# Altium project Laser-Light cueing.PrjPcb
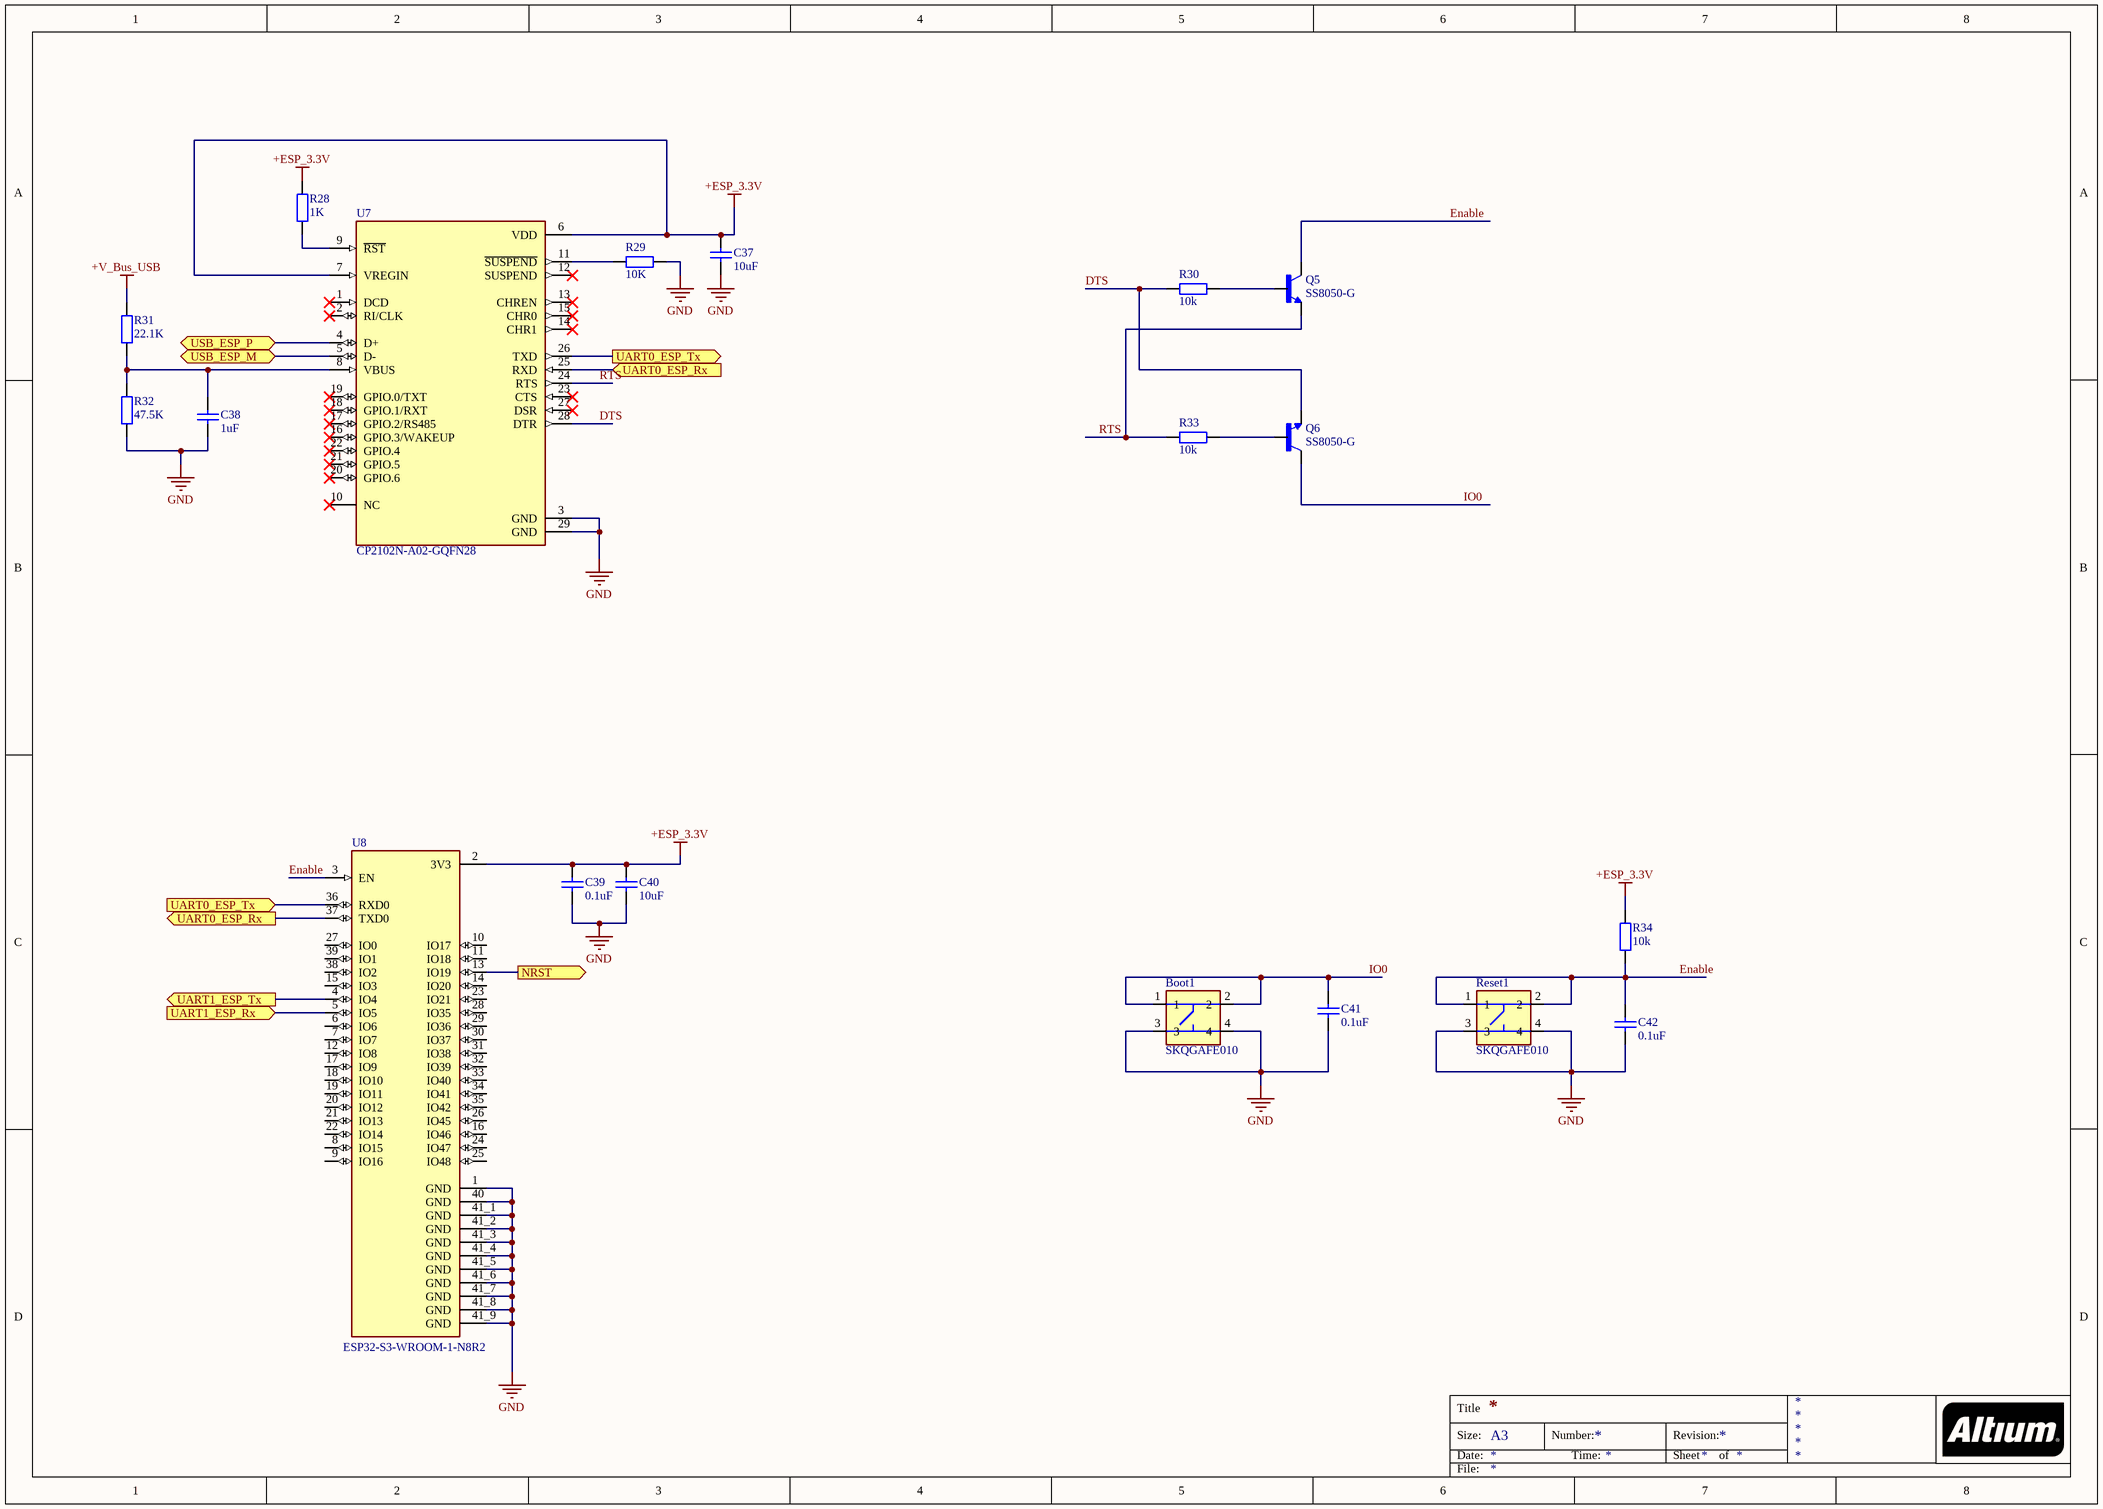
[diagram p0: ESP32.SchDoc]
5 sheets, 116 parts. Net scope: flat (ports and power ports of the same name join across sheets).
Sheets:
  ESP32.SchDoc
  AnalogSensor.SchDoc
  STM32.SchDoc
  Peripherial.SchDoc
  PWR_SRC.SchDoc

## Sheet ESP32.SchDoc
size A3

### Parts
Boot1  SKQGAFE010  [SW_SKQGAFE010]
C37  10uF  [tu 0805]
C38  1uF  [tu 0805]
C39  0.1uF  [tu 0805]
C40  10uF  [tu 0805]
C41  0.1uF  [tu 0805]
C42  0.1uF  [tu 0805]
Q5  SS8050-G  [TRANS_SS8050-G]
Q6  SS8050-G  [TRANS_SS8050-G]
R28  1K  [tro smd 0805]
R29  10K  [tro smd 0805]
R30  10k  [tro smd 0805]
R31  22.1K  [tro smd 0805]
R32  47.5K  [tro smd 0805]
R33  10k  [tro smd 0805]
R34  10k  [tro smd 0805]
Reset1  SKQGAFE010  [SW_SKQGAFE010]
U7  CP2102N-A02-GQFN28  [QFN50P500X500X80-29N]
U8  ESP32-S3-WROOM-1-N8R2  [XCVR_ESP32-S3-WROOM-1-N8R2]

### Ports
NRST (out), UART0_ESP_Rx (in), UART0_ESP_Rx (out), UART0_ESP_Tx (in), UART0_ESP_Tx (out), UART1_ESP_Rx (in), UART1_ESP_Tx (out), USB_ESP_M (bidir), USB_ESP_P (bidir)

### Nets
+ESP_3.3V: C37.1 C39.2 C40.1 R28.2 R34.2 U7.6(VDD) U7.7(VREGIN) U8.2(3V3)
+V_Bus_USB: R31.1
GND: Boot1.3 Boot1.4 C37.2 C38.2 C39.1 C40.2 C41.1 C42.1 R29.1 R32.1 Reset1.3 Reset1.4 U7.3(GND) U7.29(GND) U8.1(GND) U8.40(GND) U8.41_1(GND) U8.41_2(GND) U8.41_3(GND) U8.41_4(GND) U8.41_5(GND) U8.41_6(GND) U8.41_7(GND) U8.41_8(GND) U8.41_9(GND)
DTS: Q6.2(E) R30.1 U7.28(DTR)
Enable: C42.2 Q5.3(C) R34.1 Reset1.1 Reset1.2 U8.3(EN)
IO0: Boot1.1 Boot1.2 C41.2 Q6.3(C)
NRST: U8.13(IO19) ; port NRST
RTS: Q5.2(E) R33.1 U7.24(RTS)
NetC38_1: C38.1 R31.2 R32.2 U7.8(VBUS)
NetD7_2: U7.4(D+) ; port USB_ESP_P
NetD8_2: U7.5(D-) ; port USB_ESP_M
NetQ5_1: Q5.1(B) R30.2
NetQ6_1: Q6.1(B) R33.2
NetR28_1: R28.1 U7.9(~{RST})
NetR29_2: R29.2 U7.11(~{SUSPEND})
NetU7_25: U7.25(RXD) U8.37(TXD0) ; port UART0_ESP_Rx
NetU7_26: U7.26(TXD) U8.36(RXD0) ; port UART0_ESP_Tx
NetU8_4: U8.4(IO4) ; port UART1_ESP_Tx
NetU8_5: U8.5(IO5) ; port UART1_ESP_Rx

Not connected (* = marked no-connect by the designer): U7 1(DCD)* 2(RI/CLK)* 10(NC)* 12(SUSPEND)* 13(CHREN)* 14(CHR1)* 15(CHR0)* 16(GPIO.3/WAKEUP)* 17(GPIO.2/RS485)* 18(GPIO.1/RXT)* 19(GPIO.0/TXT)* 20(GPIO.6)* 21(GPIO.5)* 22(GPIO.4)* 23(CTS)* 27(DSR)*; U8 6(IO6) 7(IO7) 8(IO15) 9(IO16) 10(IO17) 11(IO18) 12(IO8) 14(IO20) 15(IO3) 16(IO46) 17(IO9) 18(IO10) 19(IO11) 20(IO12) 21(IO13) 22(IO14) 23(IO21) 24(IO47) 25(IO48) 26(IO45) 27(IO0) 28(IO35) 29(IO36) 30(IO37) 31(IO38) 32(IO39) 33(IO40) 34(IO41) 35(IO42) 38(IO2) 39(IO1)

### Notes on the sheet
- Title
- Size:
- Date:
- A3
- Number:
- Time:
- Revision:
- Sheet
- of
- File:

### Library data of the parts
Boot1 Reset1 = SKQGAFE010: Switch Tactile N.O. SPST Button Gull Wing 0.05A 12VDC 0.98N SMD T/R; MF: {'manufacturer': u'ALPS'}; Package: None; Price: None; Value: *; MP: SKQGAFE010; Availability: Unavailable
C37-C42 = Tu 0805 10pF 50V 10%: Dán; Don_Vi: Con; So_Chan: 2; Ten_Linh_Kien: Tụ 0805 10P 10% 50V; Ma_Hang: MH004554; Chung_Loai: Dán; Kieu_Chan: *
Q5 Q6 = SS8050-G: Bipolar (BJT) Transistor NPN 25 V 1.5 A 100MHz 300 mW Surface Mount SOT-23-3; MF: {'manufacturer': u'Comchip Technology'}; Package: None; Price: None; Value: *; MP: SS8050-G; Availability: Unavailable
R28-R34 = Tro 0805 1% 1k: Dán; Don_Vi: Con; So_Chan: 2; Ten_Linh_Kien: Trở 0805 1% 1k; Ma_Hang: MH005468; Chung_Loai: Dán; Kieu_Chan: *
U7 = CP2102N-A02-GQFN28: MF: {'manufacturer': u'Silicon Labs'}; Package: None; Price: None; Value: *; MP: CP2102N-A02-GQFN28; Availability: Unavailable
U8 = ESP32-S3-WROOM-1-N8R2: MF: {'manufacturer': u'Espressif Systems'}; Package: None; Price: None; Value: *; MP: ESP32-S3-WROOM-1-N8R2; Availability: Unavailable

## Sheet AnalogSensor.SchDoc
size A
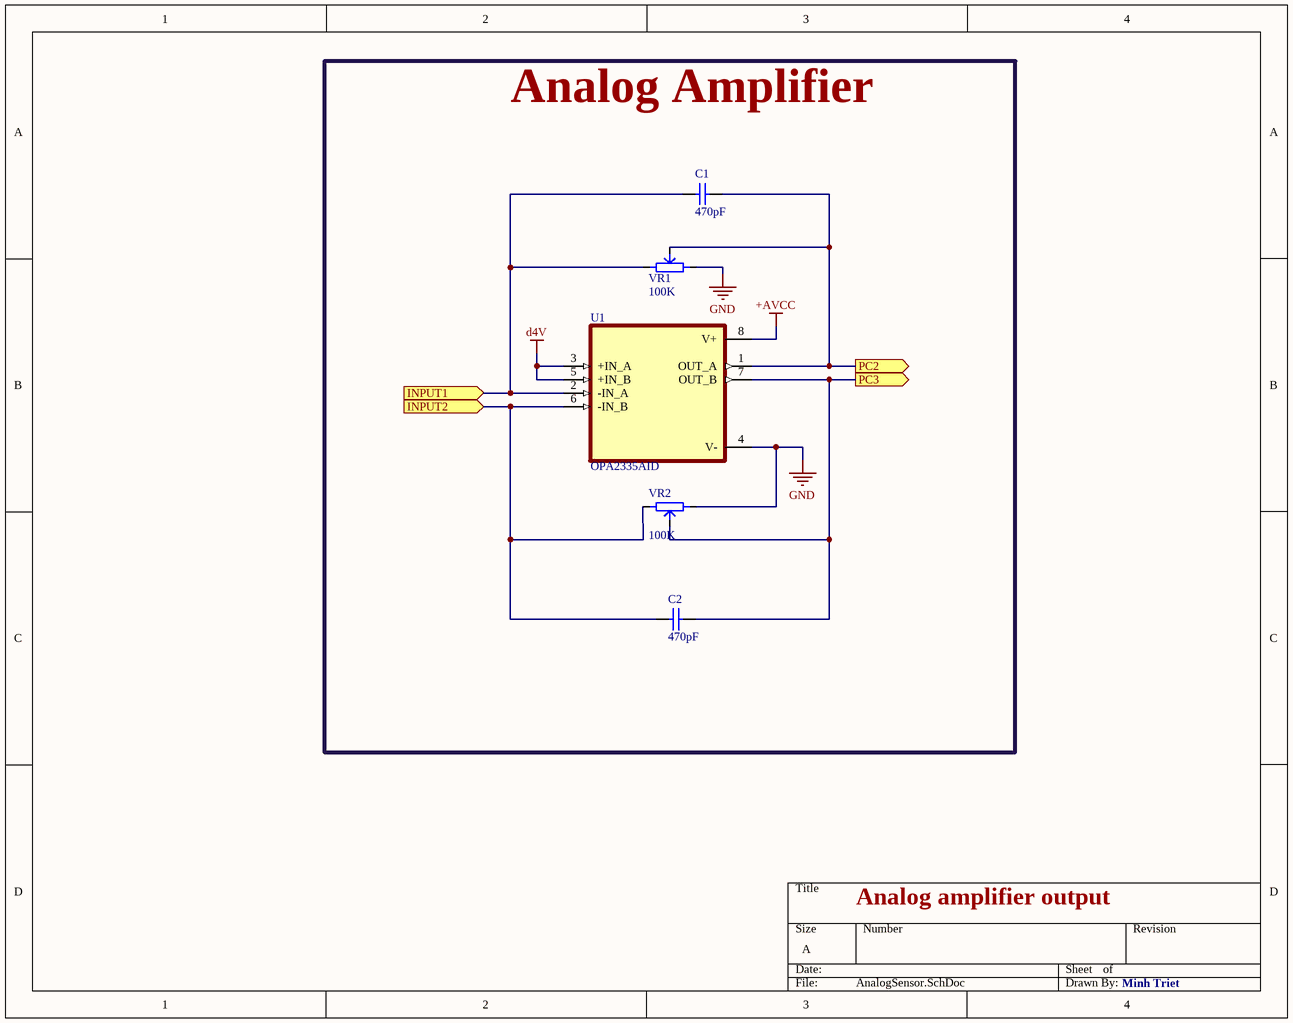
[diagram p1: AnalogSensor.SchDoc]

### Parts
C1  470pF  [tu 0603]
C2  470pF  [tu 0603]
U1  OPA2335AID  [SOIC127P599X175-8N]
VR1  100K  [Bien Tro Tam Giac Dung]
VR2  100K  [Bien Tro Tam Giac Dung]

### Blocks framed on the sheet
Analog Amplifier: C1 C2 U1 VR1 VR2

### Ports
INPUT1 (in), INPUT2 (in), PC2 (out), PC3 (out)

### Nets
+AVCC: U1.8(V+)
d4V: U1.3(+IN_A) U1.5(+IN_B)
GND: U1.4(V-) VR1.3 VR2.1
NetADC1_1: C1.2 U1.2(-IN_A) VR1.1 ; port INPUT1
NetADC2_1: C2.2 U1.6(-IN_B) VR2.3 ; port INPUT2
NetC1_1: C1.1 U1.1(OUT_A) VR1.2 ; port PC2
NetC2_1: C2.1 U1.7(OUT_B) VR2.2 ; port PC3

### Notes on the sheet
- Analog amplifier output
- Minh Triet

### Library data of the parts
C1 C2 = Tu 0603 470pF 50V 10%: Dán; Don_Vi: Con; So_Chan: 2; Ten_Linh_Kien: Tụ 0603 470P 50V 10%; Ma_Hang: MH004571; Chung_Loai: Dán; Kieu_Chan: *
U1 = OPA2335AID: MF: {'manufacturer': u'Texas Instruments'}; Package: None; Price: None; Value: *; MP: OPA2335AID; Availability: Unavailable
VR1 VR2 = Bien tro tam giac 100K Dung: Cắm; Don_Vi: Con; Ten_Linh_Kien: Biến Trở Tam Giác 104-100K RM065; Ma_Hang: MH003711; Chung_Loai: Cắm; Ghi_Chu: *; Kieu_Chan: *

## Sheet STM32.SchDoc
size A2
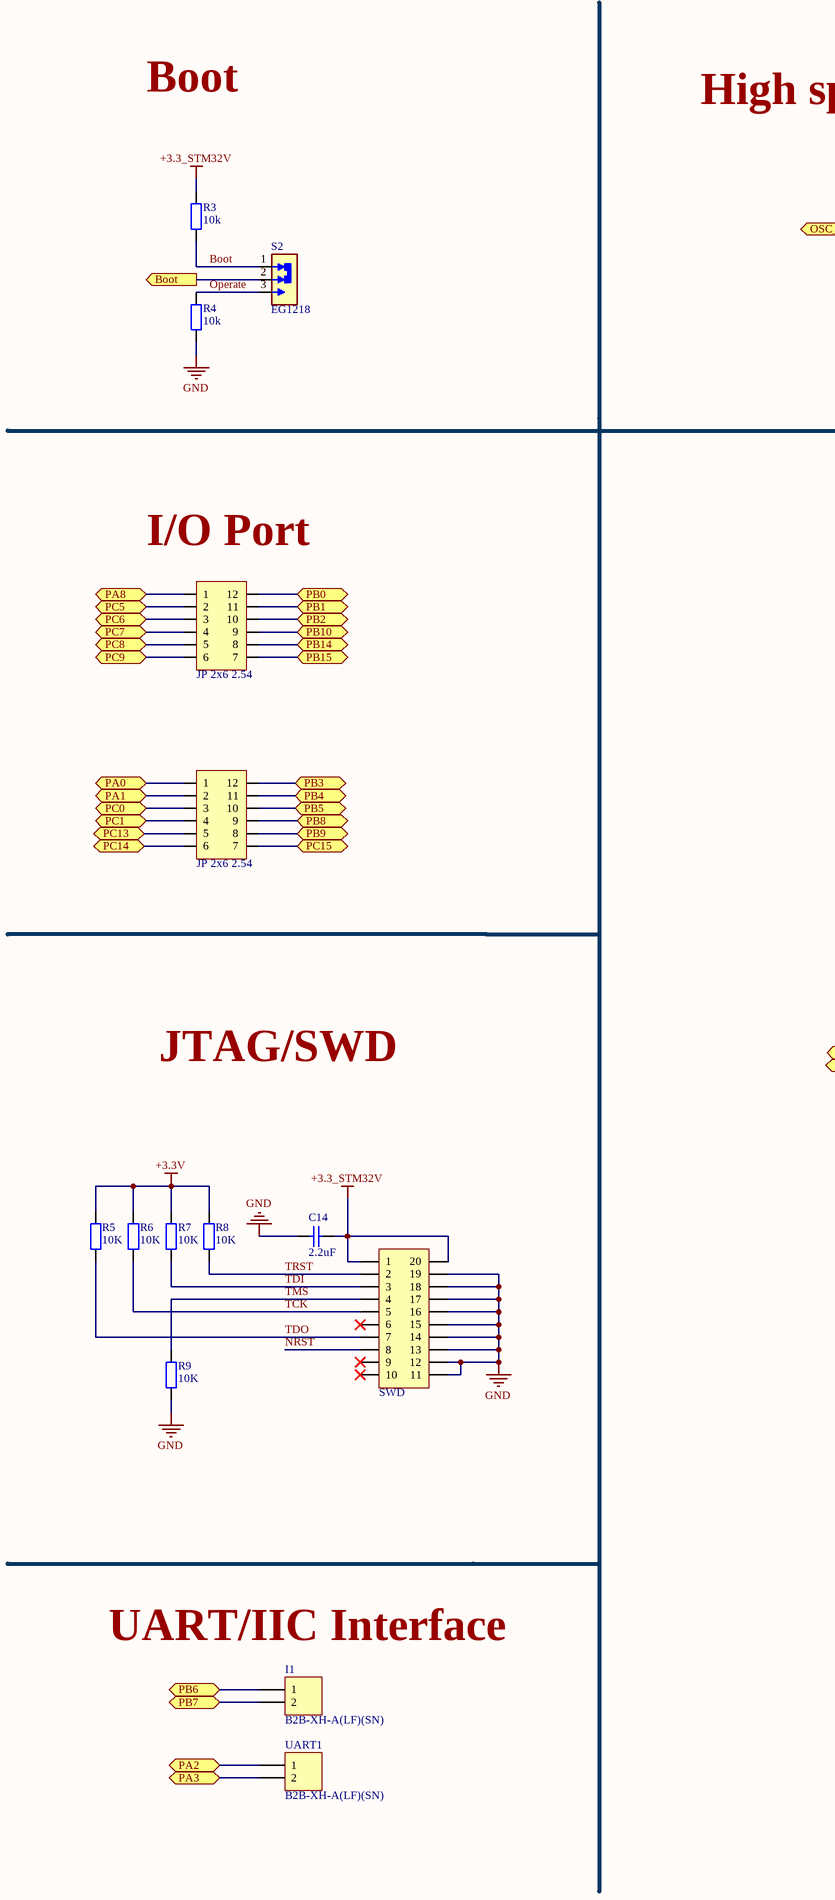
[diagram p2: STM32.SchDoc, left]
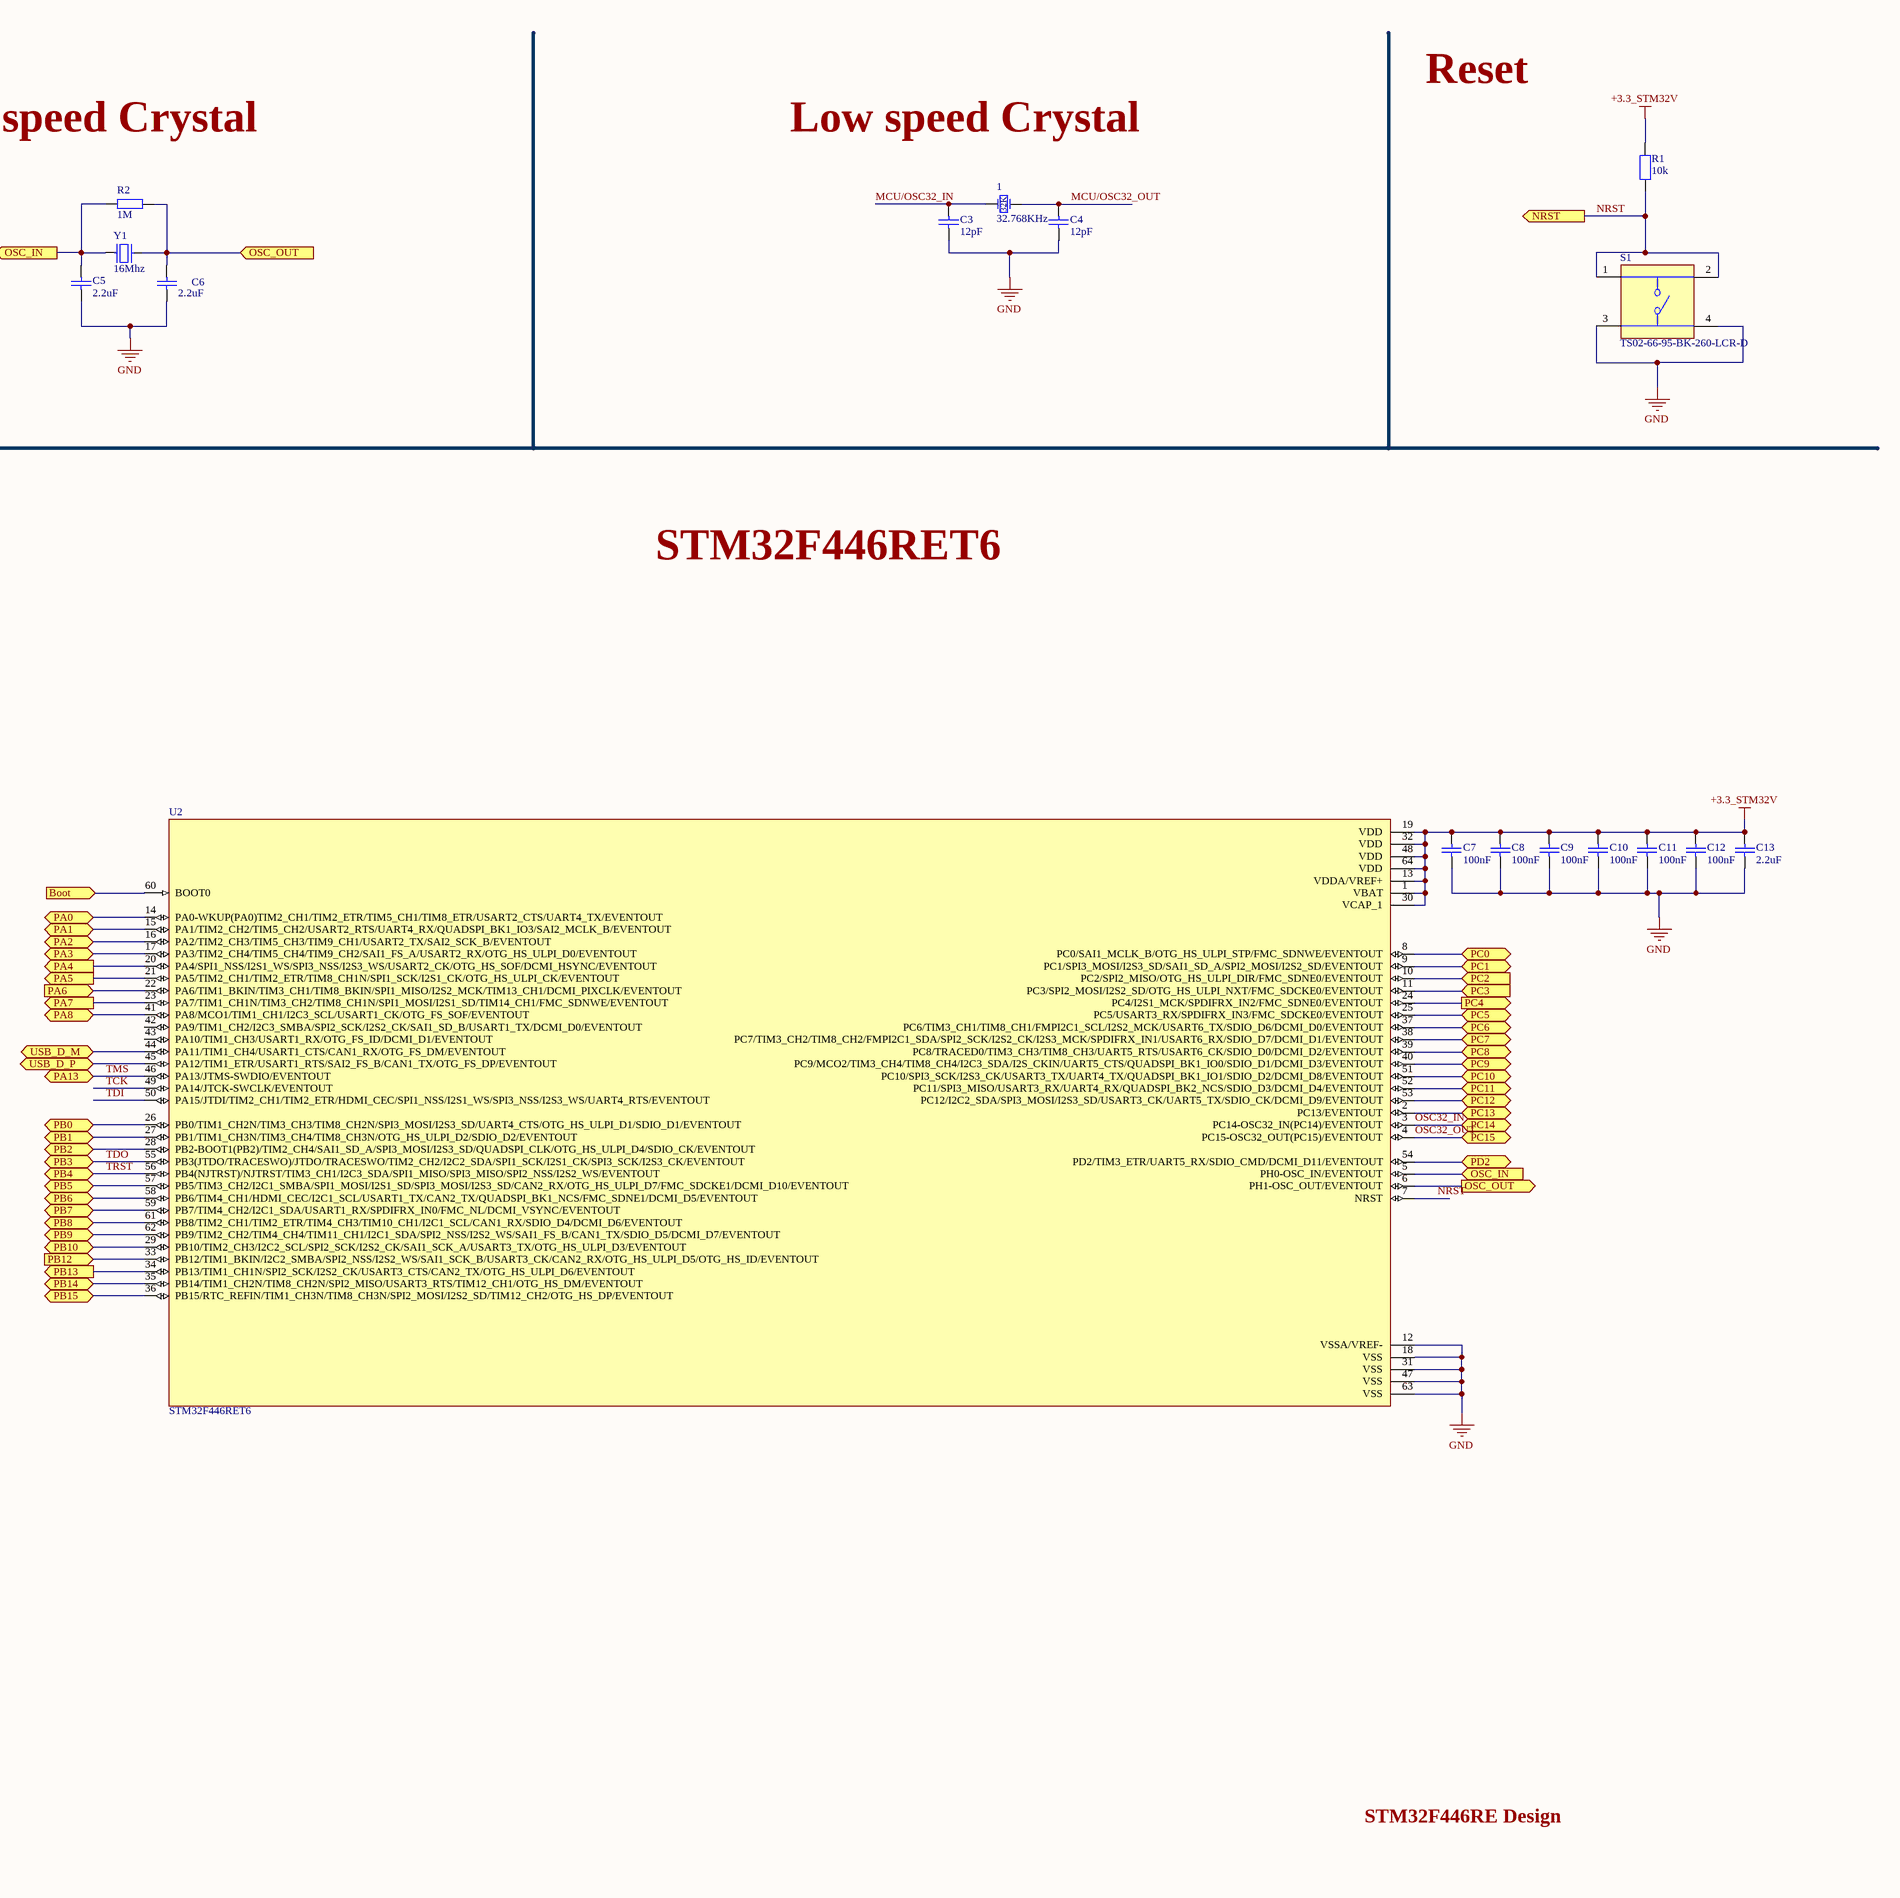
[diagram p3: STM32.SchDoc, right]

### Parts
1  32.768KHz  [Crystal_ABS07_SMD-3.2x1.5MM]
C3  12pF  [tu 0805]
C4  12pF  [tu 0805]
C5  2.2uF  [tu 0805]
C6  2.2uF  [tu 0805]
C7  100nF  [tu 0805]
C8  100nF  [tu 0805]
C9  100nF  [tu 0805]
C10  100nF  [tu 0805]
C11  100nF  [tu 0805]
C12  100nF  [tu 0805]
C13  2.2uF  [tu 0805]
C14  2.2uF  [tu 0805]
I1  B2B-XH-A(LF)(SN)  [CON2_100_B2B-XH-A_TH_ST]
JP1  JP 2x6 2.54  [JP 2x6 DT]
JP2  JP 2x6 2.54  [JP 2x6 DT]
JTAG/SWD1  SWD  [JP 2x10 DT]
R1  10k  [tro smd 0805]
R2  1M  [tro smd 0805]
R3  10k  [tro smd 0805]
R4  10k  [tro smd 0805]
R5  10K  [tro smd 0805]
R6  10K  [tro smd 0805]
R7  10K  [tro smd 0805]
R8  10K  [tro smd 0805]
R9  10K  [tro smd 0805]
S1  TS02-66-95-BK-260-LCR-D  [SW_TS02-66-95-BK-260-LCR-D]
S2  EG1218  [SW_EG1218]
U2  STM32F446RET6  [QFP50P1200X1200X160-64N]
UART1  B2B-XH-A(LF)(SN)  [CON2_100_B2B-XH-A_TH_ST]
Y1  16Mhz  [Thach Anh 2 chan cam]

### Ports
Boot (in), Boot (out), NRST (out), OSC_IN (in), OSC_IN (out), OSC_OUT (in), OSC_OUT (out), PA0 (bidir), PA1 (bidir), PA2 (bidir), PA3 (bidir), PA4 (out), PA5 (out), PA6 (in), PA7 (out), PA8 (bidir), PA13 (bidir), PB0 (bidir), PB1 (bidir), PB2 (bidir), PB3 (bidir), PB4 (bidir), PB5 (bidir), PB6 (bidir), PB7 (bidir), PB8 (bidir), PB9 (bidir), PB10 (bidir), PB12 (in), PB13 (out), PB14 (bidir), PB15 (bidir), PC0 (bidir), PC1 (bidir), PC2 (in), PC3 (in), PC4 (out), PC5 (bidir), PC6 (bidir), PC7 (bidir), PC8 (bidir), PC9 (bidir), PC10 (bidir), PC11 (bidir), PC12 (bidir), PC13 (bidir), PC14 (bidir), PC15 (bidir), PD2 (bidir), USB_D_M (bidir), USB_D_P (bidir)

### Nets
+3.3_STM32V: C7.1 C8.1 C9.1 C10.1 C11.1 C12.1 C13.1 C14.2 JTAG/SWD1.1 JTAG/SWD1.20 R1.1 R3.1 U2.1(VBAT) U2.13(VDDA/VREF+) U2.19(VDD) U2.30(VCAP_1) U2.32(VDD) U2.48(VDD) U2.64(VDD)
+3.3V: R5.2 R6.2 R7.2 R8.2
GND: C3.2 C4.2 C5.2 C6.2 C7.2 C8.2 C9.2 C10.2 C11.2 C12.2 C13.2 C14.1 JTAG/SWD1.11 JTAG/SWD1.12 JTAG/SWD1.13 JTAG/SWD1.14 JTAG/SWD1.15 JTAG/SWD1.16 JTAG/SWD1.17 JTAG/SWD1.18 JTAG/SWD1.19 R4.2 R9.1 S1.3 S1.4 U2.12(VSSA/VREF-) U2.18(VSS) U2.31(VSS) U2.47(VSS) U2.63(VSS)
Boot: R3.2 S2.1(NC)
MCU/OSC32_IN: 1.1(OSC1) C3.1
MCU/OSC32_OUT: 1.2(OSC2) C4.1
NRST: JTAG/SWD1.8 R1.2 S1.1 S1.2 U2.7(NRST) ; port NRST
Operate: R4.1 S2.3(NO)
OSC32_IN: JP2.6 U2.3(PC14-OSC32_IN(PC14)/EVENTOUT) ; port PC14
OSC32_OUT: JP2.7 U2.4(PC15-OSC32_OUT(PC15)/EVENTOUT) ; port PC15
TCK: JTAG/SWD1.5 R6.1 U2.49(PA14/JTCK-SWCLK/EVENTOUT)
TDI: JTAG/SWD1.3 R7.1 U2.50(PA15/JTDI/TIM2_CH1/TIM2_ETR/HDMI_CEC/SPI1_NSS/I2S1_WS/SPI3_NSS/I2S3_WS/UART4_RTS/EVENTOUT)
TDO: JP2.12 JTAG/SWD1.7 R5.1 U2.55(PB3(JTDO/TRACESWO)/JTDO/TRACESWO/TIM2_CH2/I2C2_SDA/SPI1_SCK/I2S1_CK/SPI3_SCK/I2S3_CK/EVENTOUT) ; port PB3
TMS: JTAG/SWD1.4 R9.2 U2.46(PA13/JTMS-SWDIO/EVENTOUT) ; port PA13
TRST: JP2.11 JTAG/SWD1.2 R8.1 U2.56(PB4(NJTRST)/NJTRST/TIM3_CH1/I2C3_SDA/SPI1_MISO/SPI3_MISO/SPI2_NSS/I2S2_WS/EVENTOUT) ; port PB4
NetC1_1: U2.10(PC2/SPI2_MISO/OTG_HS_ULPI_DIR/FMC_SDNE0/EVENTOUT) ; port PC2
NetC2_1: U2.11(PC3/SPI2_MOSI/I2S2_SD/OTG_HS_ULPI_NXT/FMC_SDCKE0/EVENTOUT) ; port PC3
NetC5_1: C5.1 R2.1 U2.5(PH0-OSC_IN/EVENTOUT) Y1.1 ; port OSC_IN
NetC6_1: C6.1 R2.2 U2.6(PH1-OSC_OUT/EVENTOUT) Y1.2 ; port OSC_OUT
NetCAN1_1: U2.34(PB13/TIM1_CH1N/SPI2_SCK/I2S2_CK/USART3_CTS/CAN2_TX/OTG_HS_ULPI_D6/EVENTOUT) ; port PB13
NetCAN1_4: U2.33(PB12/TIM1_BKIN/I2C2_SMBA/SPI2_NSS/I2S2_WS/SAI1_SCK_B/USART3_CK/CAN2_RX/OTG_HS_ULPI_D5/OTG_HS_ID/EVENTOUT) ; port PB12
NetD3_2: U2.45(PA12/TIM1_ETR/USART1_RTS/SAI2_FS_B/CAN1_TX/OTG_FS_DP/EVENTOUT) ; port USB_D_P
NetD4_2: U2.44(PA11/TIM1_CH4/USART1_CTS/CAN1_RX/OTG_FS_DM/EVENTOUT) ; port USB_D_M
NetI1_1: I1.1 U2.58(PB6/TIM4_CH1/HDMI_CEC/I2C1_SCL/USART1_TX/CAN2_TX/QUADSPI_BK1_NCS/FMC_SDNE1/DCMI_D5/EVENTOUT) ; port PB6
NetI1_2: I1.2 U2.59(PB7/TIM4_CH2/I2C1_SDA/USART1_RX/SPDIFRX_IN0/FMC_NL/DCMI_VSYNC/EVENTOUT) ; port PB7
NetJP1_1: JP1.1 U2.41(PA8/MCO1/TIM1_CH1/I2C3_SCL/USART1_CK/OTG_FS_SOF/EVENTOUT) ; port PA8
NetJP1_2: JP1.2 U2.25(PC5/USART3_RX/SPDIFRX_IN3/FMC_SDCKE0/EVENTOUT) ; port PC5
NetJP1_3: JP1.3 U2.37(PC6/TIM3_CH1/TIM8_CH1/FMPI2C1_SCL/I2S2_MCK/USART6_TX/SDIO_D6/DCMI_D0/EVENTOUT) ; port PC6
NetJP1_4: JP1.4 U2.38(PC7/TIM3_CH2/TIM8_CH2/FMPI2C1_SDA/SPI2_SCK/I2S2_CK/I2S3_MCK/SPDIFRX_IN1/USART6_RX/SDIO_D7/DCMI_D1/EVENTOUT) ; port PC7
NetJP1_5: JP1.5 U2.39(PC8/TRACED0/TIM3_CH3/TIM8_CH3/UART5_RTS/USART6_CK/SDIO_D0/DCMI_D2/EVENTOUT) ; port PC8
NetJP1_6: JP1.6 U2.40(PC9/MCO2/TIM3_CH4/TIM8_CH4/I2C3_SDA/I2S_CKIN/UART5_CTS/QUADSPI_BK1_IO0/SDIO_D1/DCMI_D3/EVENTOUT) ; port PC9
NetJP1_7: JP1.7 U2.36(PB15/RTC_REFIN/TIM1_CH3N/TIM8_CH3N/SPI2_MOSI/I2S2_SD/TIM12_CH2/OTG_HS_DP/EVENTOUT) ; port PB15
NetJP1_8: JP1.8 U2.35(PB14/TIM1_CH2N/TIM8_CH2N/SPI2_MISO/USART3_RTS/TIM12_CH1/OTG_HS_DM/EVENTOUT) ; port PB14
NetJP1_9: JP1.9 U2.29(PB10/TIM2_CH3/I2C2_SCL/SPI2_SCK/I2S2_CK/SAI1_SCK_A/USART3_TX/OTG_HS_ULPI_D3/EVENTOUT) ; port PB10
NetJP1_10: JP1.10 U2.28(PB2-BOOT1(PB2)/TIM2_CH4/SAI1_SD_A/SPI3_MOSI/I2S3_SD/QUADSPI_CLK/OTG_HS_ULPI_D4/SDIO_CK/EVENTOUT) ; port PB2
NetJP1_11: JP1.11 U2.27(PB1/TIM1_CH3N/TIM3_CH4/TIM8_CH3N/OTG_HS_ULPI_D2/SDIO_D2/EVENTOUT) ; port PB1
NetJP1_12: JP1.12 U2.26(PB0/TIM1_CH2N/TIM3_CH3/TIM8_CH2N/SPI3_MOSI/I2S3_SD/UART4_CTS/OTG_HS_ULPI_D1/SDIO_D1/EVENTOUT) ; port PB0
NetJP2_1: JP2.1 U2.14(PA0-WKUP(PA0)TIM2_CH1/TIM2_ETR/TIM5_CH1/TIM8_ETR/USART2_CTS/UART4_TX/EVENTOUT) ; port PA0
NetJP2_2: JP2.2 U2.15(PA1/TIM2_CH2/TIM5_CH2/USART2_RTS/UART4_RX/QUADSPI_BK1_IO3/SAI2_MCLK_B/EVENTOUT) ; port PA1
NetJP2_3: JP2.3 U2.8(PC0/SAI1_MCLK_B/OTG_HS_ULPI_STP/FMC_SDNWE/EVENTOUT) ; port PC0
NetJP2_4: JP2.4 U2.9(PC1/SPI3_MOSI/I2S3_SD/SAI1_SD_A/SPI2_MOSI/I2S2_SD/EVENTOUT) ; port PC1
NetJP2_5: JP2.5 U2.2(PC13/EVENTOUT) ; port PC13
NetJP2_8: JP2.8 U2.62(PB9/TIM2_CH2/TIM4_CH4/TIM11_CH1/I2C1_SDA/SPI2_NSS/I2S2_WS/SAI1_FS_B/CAN1_TX/SDIO_D5/DCMI_D7/EVENTOUT) ; port PB9
NetJP2_9: JP2.9 U2.61(PB8/TIM2_CH1/TIM2_ETR/TIM4_CH3/TIM10_CH1/I2C1_SCL/CAN1_RX/SDIO_D4/DCMI_D6/EVENTOUT) ; port PB8
NetJP2_10: JP2.10 U2.57(PB5/TIM3_CH2/I2C1_SMBA/SPI1_MOSI/I2S1_SD/SPI3_MOSI/I2S3_SD/CAN2_RX/OTG_HS_ULPI_D7/FMC_SDCKE1/DCMI_D10/EVENTOUT) ; port PB5
NetS2_2: S2.2(COM) U2.60(BOOT0) ; port Boot
NetU2_16: U2.16(PA2/TIM2_CH3/TIM5_CH3/TIM9_CH1/USART2_TX/SAI2_SCK_B/EVENTOUT) UART1.1 ; port PA2
NetU2_17: U2.17(PA3/TIM2_CH4/TIM5_CH4/TIM9_CH2/SAI1_FS_A/USART2_RX/OTG_HS_ULPI_D0/EVENTOUT) UART1.2 ; port PA3
NetU2_20: U2.20(PA4/SPI1_NSS/I2S1_WS/SPI3_NSS/I2S3_WS/USART2_CK/OTG_HS_SOF/DCMI_HSYNC/EVENTOUT) ; port PA4
NetU2_21: U2.21(PA5/TIM2_CH1/TIM2_ETR/TIM8_CH1N/SPI1_SCK/I2S1_CK/OTG_HS_ULPI_CK/EVENTOUT) ; port PA5
NetU2_22: U2.22(PA6/TIM1_BKIN/TIM3_CH1/TIM8_BKIN/SPI1_MISO/I2S2_MCK/TIM13_CH1/DCMI_PIXCLK/EVENTOUT) ; port PA6
NetU2_23: U2.23(PA7/TIM1_CH1N/TIM3_CH2/TIM8_CH1N/SPI1_MOSI/I2S1_SD/TIM14_CH1/FMC_SDNWE/EVENTOUT) ; port PA7
NetU2_24: U2.24(PC4/I2S1_MCK/SPDIFRX_IN2/FMC_SDNE0/EVENTOUT) ; port PC4
NetU2_51: U2.51(PC10/SPI3_SCK/I2S3_CK/USART3_TX/UART4_TX/QUADSPI_BK1_IO1/SDIO_D2/DCMI_D8/EVENTOUT) ; port PC10
NetU2_52: U2.52(PC11/SPI3_MISO/USART3_RX/UART4_RX/QUADSPI_BK2_NCS/SDIO_D3/DCMI_D4/EVENTOUT) ; port PC11
NetU2_53: U2.53(PC12/I2C2_SDA/SPI3_MOSI/I2S3_SD/USART3_CK/UART5_TX/SDIO_CK/DCMI_D9/EVENTOUT) ; port PC12
NetU2_54: U2.54(PD2/TIM3_ETR/UART5_RX/SDIO_CMD/DCMI_D11/EVENTOUT) ; port PD2

Not connected (* = marked no-connect by the designer): JTAG/SWD1 6* 9* 10*; U2 42(PA9/TIM1_CH2/I2C3_SMBA/SPI2_SCK/I2S2_CK/SAI1_SD_B/USART1_TX/DCMI_D0/EVENTOUT) 43(PA10/TIM1_CH3/USART1_RX/OTG_FS_ID/DCMI_D1/EVENTOUT)

### Notes on the sheet
- Reset
- Boot
- High speed Crystal
- Low speed Crystal
- (near JP1) I/O Port
- STM32F446RET6
- JTAG/SWD
- (near I1) UART/IIC Interface
- STM32F446RE Design
- Title
- Size:
- Date:
- File:
- A2
- Number:
- Time:
- Revision:
- Sheet
- of
- (in symbol ABS07-32.768KHZ-T) 32K

### Library data of the parts
1 = ABS07-32.768KHZ-T: CRYSTAL 32.7680KHZ 12.5pF SMD; Solder: SMT; CompanyID: VT-01153; MPN: ABS07-32.768KHZ-T; Value: 32.768KHz; Category: CRYSTAL
C3-C14 = Tu 0805 10pF 50V 10%: as C37 on sheet ESP32; Chung_Loai: Dán; Kieu_Chan: *
I1 UART1 = CON-PLG_2X1-100-ST-TH: 2 Pins, 1 Row 2.54mm Pitch, Straight Connector, male; Manufacturer: JST; Mating Part Number: XHP-2; Crimp Part Number: ASXHSXH22K51; Alternate Part Number-1: NA; Manufacturer Part Number: B2B-XH-A(LF)(SN); Case/Package: TH-CON; Supplier-1: SP ROAD; Supplier Part Number-1: B2B-XH-A(LF)(SN)
JP1 JP2 = JP 2x6 2.54 Duc Thang: Cắm; Ten_Linh_Kien: Jump Đôi Đực 2.54MM 2x40P Thẳng 11MM; Don_Vi: Con; Ma_Hang: MH002686; Ghi_Chu: *; Kieu_Chan: *; Chung_Loai: Cắm
JTAG/SWD1 = JP 2x10 2.54 Duc Thang: Cắm; Ten_Linh_Kien: Jump Đôi Đực 2.54MM 2x40P Thẳng 11MM; Don_Vi: Con; Ma_Hang: MH002686; Ghi_Chu: *; Kieu_Chan: *; Chung_Loai: Cắm
R1-R4 = Tro 0805 1% 1k: as R28 on sheet ESP32; Chung_Loai: Dán; Kieu_Chan: *
R5-R9 = Tro 0805 1% 10k: Dán; Don_Vi: Con; So_Chan: 2; Ten_Linh_Kien: Trở 0805 1% 10k; Ma_Hang: MH005473; Chung_Loai: Dán; Kieu_Chan: *
S1 = TS02-66-95-BK-260-LCR-D: MF: {'manufacturer': u'CUI Devices'}; Package: None; Price: None; Value: *; MP: TS02-66-95-BK-260-LCR-D; Availability: Unavailable
S2 = EG1218: Slide Switch, EG Series, SPDT, Non-Shorting, ON-ON, 200mA DC, 30VDC, PC Pin | E-Switch EG1218; SnapEDA_Link: https://www.snapeda.com/parts/EG1218/E-Switch/view-part/?ref=snap; Package: None; Value: *; MF: E-Switch; MP: EG1218; Check_prices: https://www.snapeda.com/parts/EG1218/E-Switch/view-part/?ref=eda
U2 = STM32F446RET6: MCU 32-Bit STM32 ARM Cortex M4 RISC 512KB Flash 2.5V/3.3V 64-Pin LQFP Tray; MF: {'manufacturer': u'STMicroelectronics'}; Package: None; Price: None; Value: *; MP: STM32F446RET6; Availability: Unavailable
Y1 = Thach Anh 2 chan Cam: Crystal For all Crystal 2pin.; Value: 4Mhz

## Sheet Peripherial.SchDoc
size A
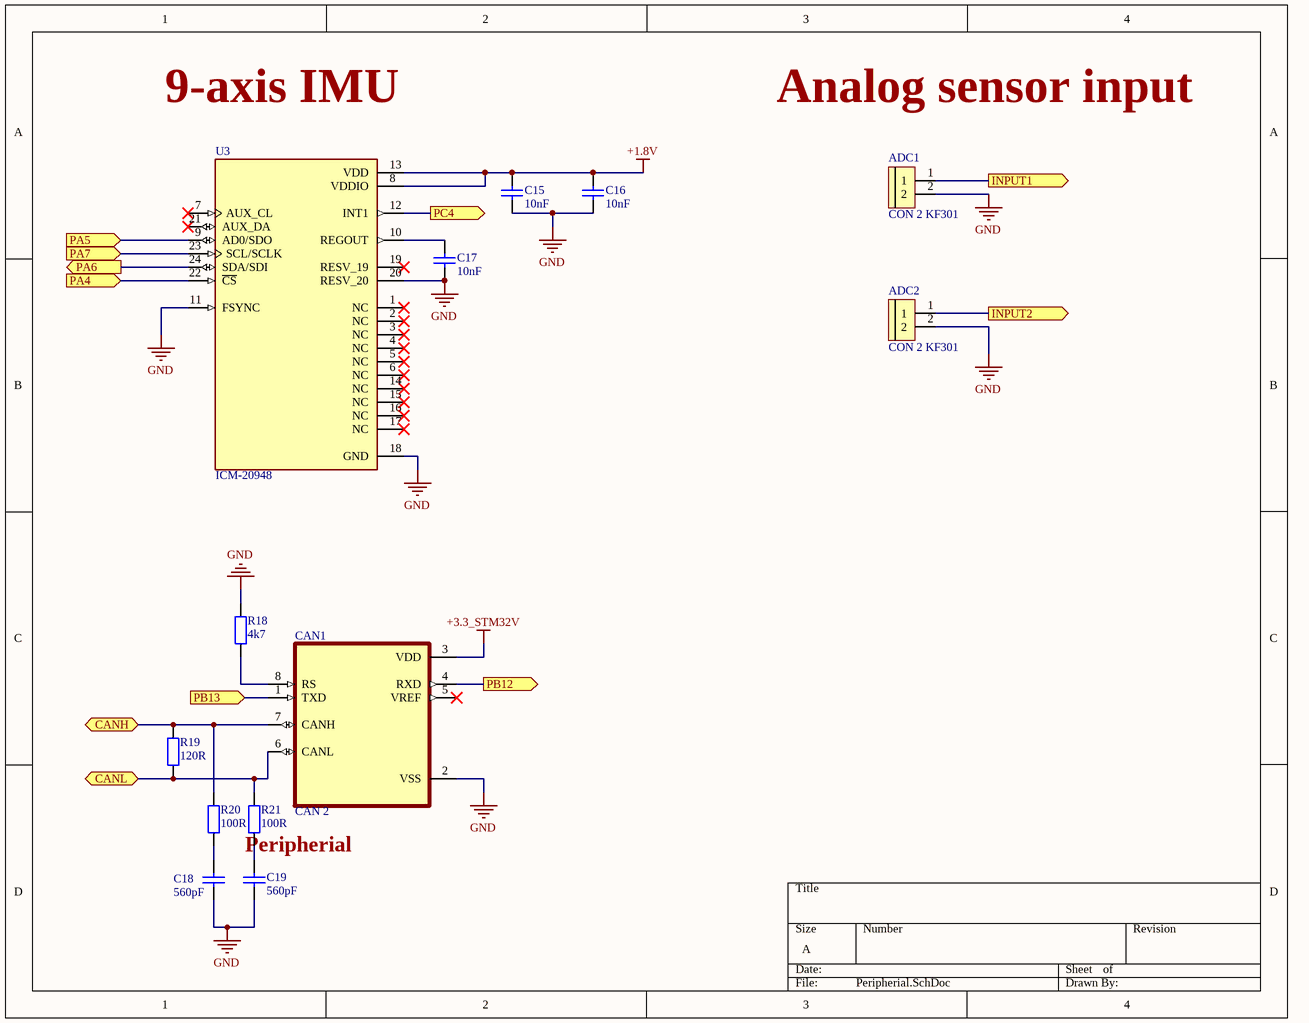
[diagram p4: Peripherial.SchDoc]

### Parts
ADC1  CON 2 KF301  [Con 2 KF301 5.08]
ADC2  CON 2 KF301  [Con 2 KF301 5.08]
C15  10nF  [tu 0805]
C16  10nF  [tu 0805]
C17  10nF  [tu 0805]
C18  560pF  [tu 0805]
C19  560pF  [tu 0805]
CAN1  CAN 2  [SOIC127P599X175-8N]
R18  4k7  [tro smd 0805]
R19  120R  [tro smd 0805]
R20  100R  [tro smd 0805]
R21  100R  [tro smd 0805]
U3  ICM-20948  [QFN40P300X300X105-24N]

### Ports
CANH (bidir), CANL (bidir), INPUT1 (out), INPUT2 (out), PA4 (in), PA5 (in), PA6 (out), PA7 (in), PB12 (out), PB13 (in), PC4 (out)

### Nets
+1.8V: C15.1 C16.1 U3.8(VDDIO) U3.13(VDD)
+3.3_STM32V: CAN1.3(VDD)
GND: ADC1.2 ADC2.2 C15.2 C16.2 C17.2 C18.2 C19.2 CAN1.2(VSS) R18.1 U3.11(FSYNC) U3.18(GND) U3.20(RESV_20)
NetADC1_1: ADC1.1 ; port INPUT1
NetADC2_1: ADC2.1 ; port INPUT2
NetC17_1: C17.1 U3.10(REGOUT)
NetC18_1: C18.1 R20.1
NetC19_1: C19.1 R21.1
NetCAN1_1: CAN1.1(TXD) ; port PB13
NetCAN1_4: CAN1.4(RXD) ; port PB12
NetCAN1_6: CAN1.6(CANL) R19.1 R21.2 ; port CANL
NetCAN1_7: CAN1.7(CANH) R19.2 R20.2 ; port CANH
NetCAN1_8: CAN1.8(RS) R18.2
NetU2_20: U3.22(~{CS}) ; port PA4
NetU2_21: U3.9(AD0/SDO) ; port PA5
NetU2_22: U3.24(SDA/SDI) ; port PA6
NetU2_23: U3.23(SCL/SCLK) ; port PA7
NetU2_24: U3.12(INT1) ; port PC4

Not connected (* = marked no-connect by the designer): CAN1 5(VREF)*; U3 1(NC)* 2(NC)* 3(NC)* 4(NC)* 5(NC)* 6(NC)* 7(AUX_CL)* 14(NC)* 15(NC)* 16(NC)* 17(NC)* 19(RESV_19)* 21(AUX_DA)*

### Notes on the sheet
- 9-axis IMU
- Analog sensor input
- (near R21) Peripherial

### Library data of the parts
ADC1 ADC2 = CON 2 KF301: Cắm; Ma_Hang: MH000987; Ten_Linh_Kien: CON 2 KF301-2P 5.08MM Xanh Dương; Chung_Loai: Cắm; Ghi_Chu: *; Kieu_Chan: *; Don_Vi: Con
C15-C19 = Tu 0805 106 16V 10%: Dán; Ten_Linh_Kien: Tụ 0805 106-10uF 10% 16V; So_Chan: 2; Don_Vi: Con; Ma_Hang: MH004553; Chung_Loai: Dán; Kieu_Chan: *
CAN1 = MCP2551-I/SN: MF: {'manufacturer': u'Microchip Technology'}; Package: None; Price: None; Value: *; MP: MCP2551-I/SN; Availability: Unavailable
R18-R21 = Tro 0805 1% 10k: as R5 on sheet STM32; Chung_Loai: Dán; Kieu_Chan: *
U3 = ICM-20948: Accelerometer, Gyroscope, Magnetometer, 9 Axis Sensor IÂ²C, SPI Output; Package: None; Value: *; Price: None; MP: ICM-20948; Availability: Unavailable

## Sheet PWR_SRC.SchDoc
size A3
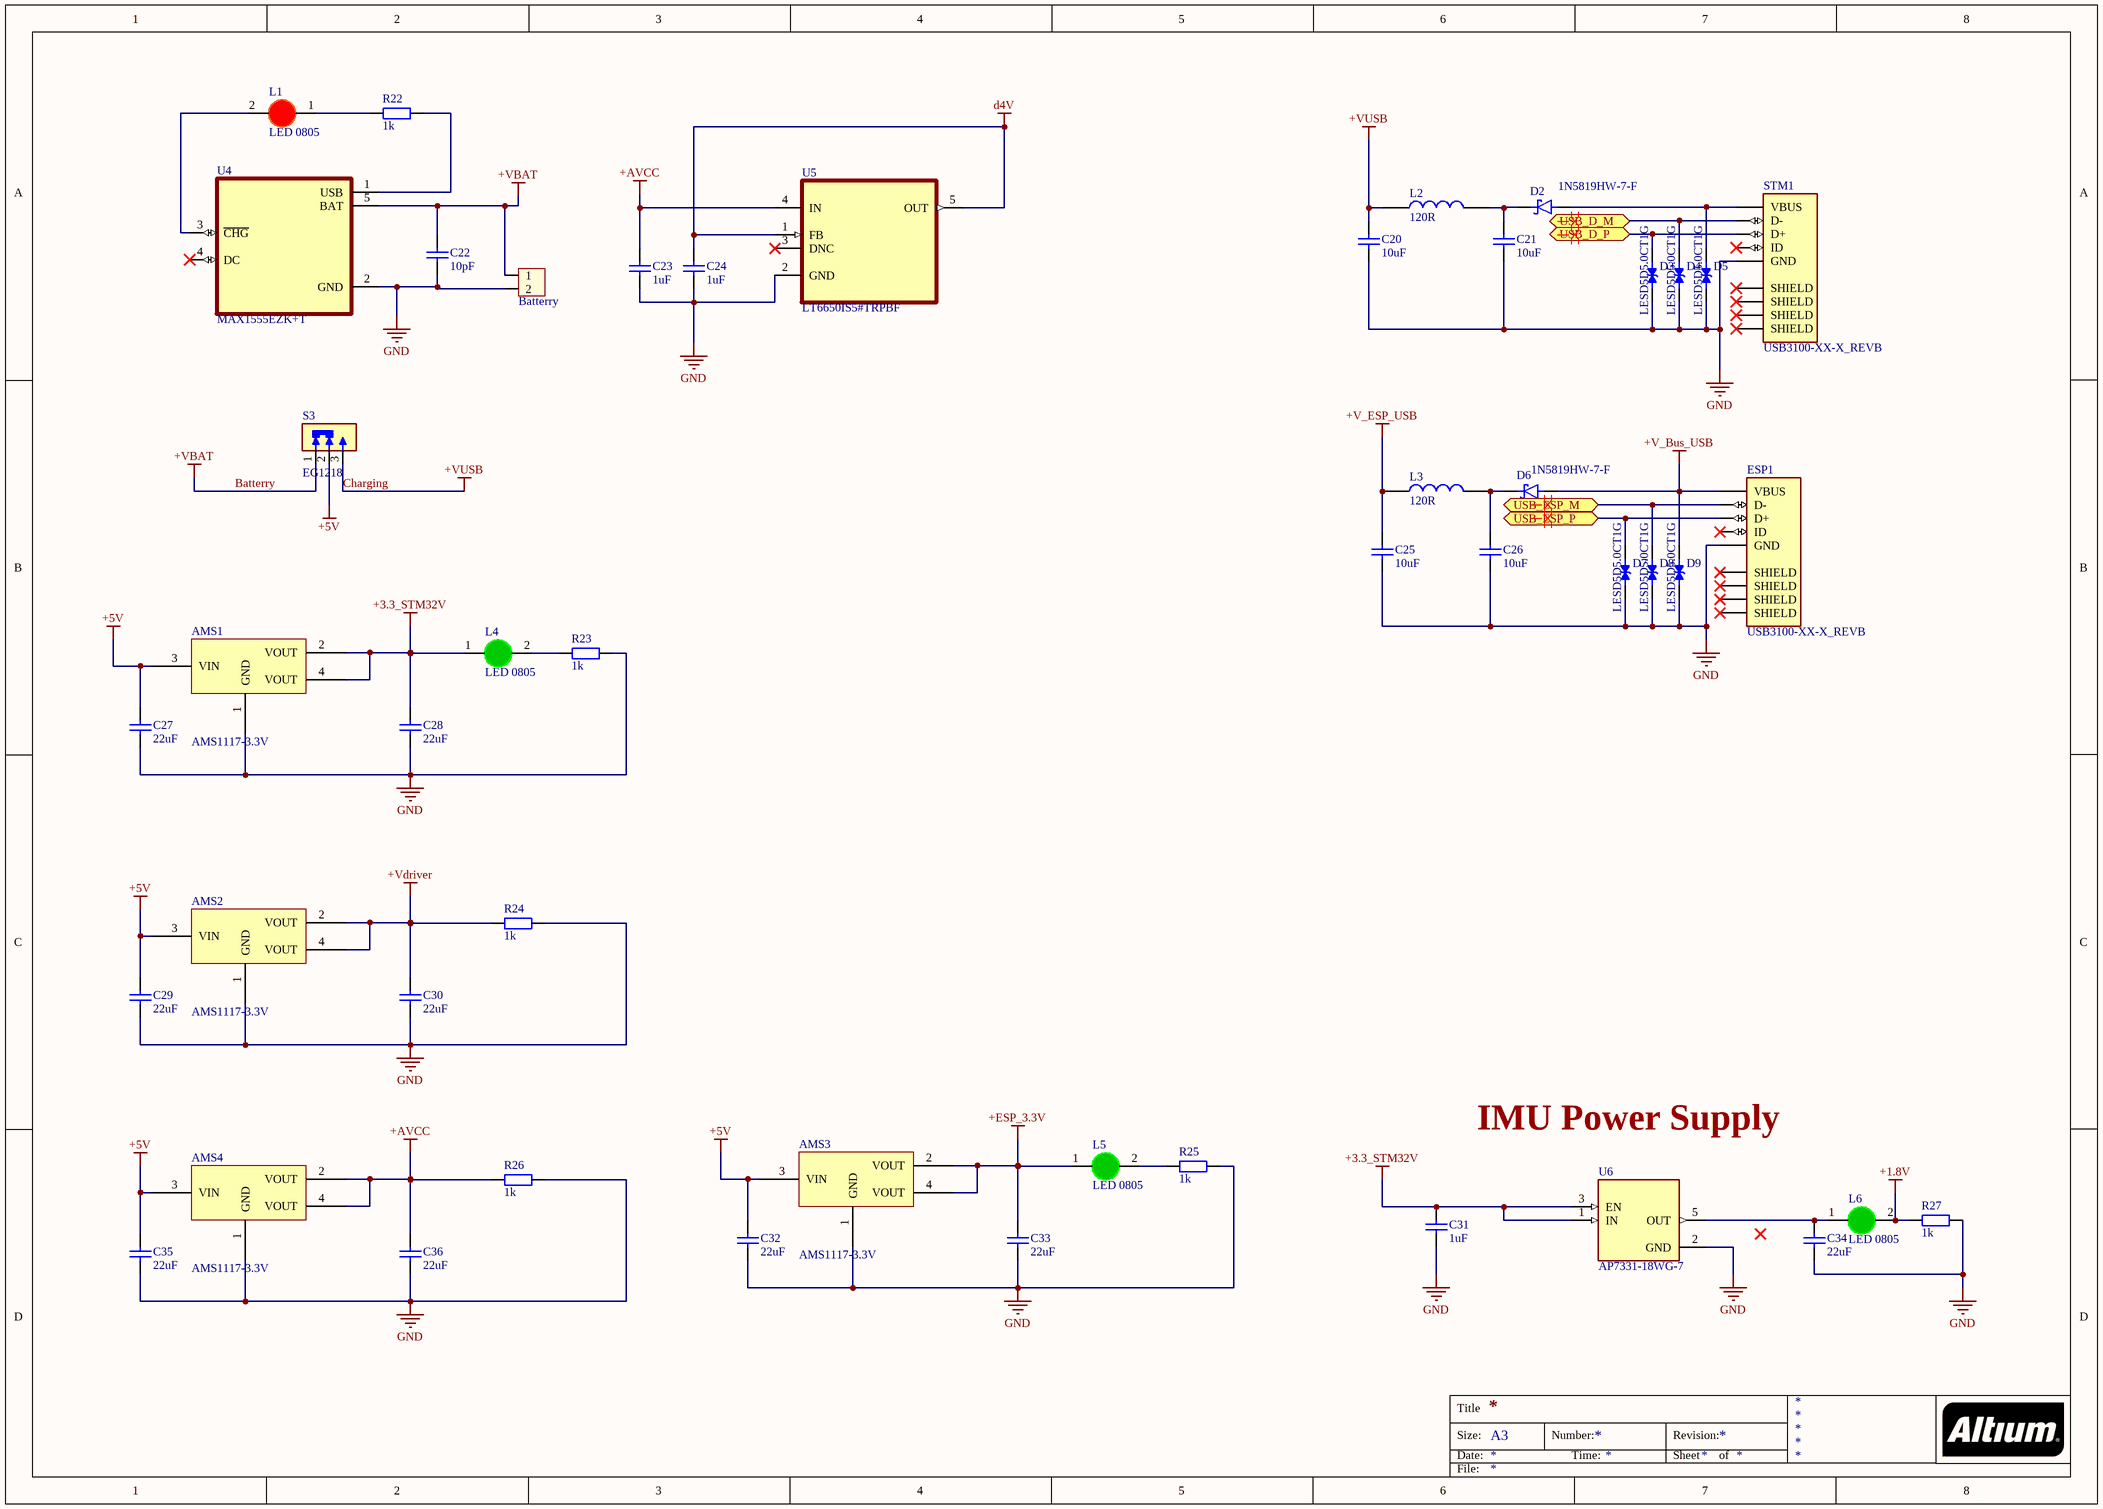
[diagram p5: PWR_SRC.SchDoc]

### Parts
AMS1  AMS1117-3.3V  [SOT223]
AMS2  AMS1117-3.3V  [SOT223]
AMS3  AMS1117-3.3V  [SOT223]
AMS4  AMS1117-3.3V  [SOT223]
Batterry1  Batterry  [XH2.54M-2]
C20  10uF  [tu 0805]
C21  10uF  [tu 0805]
C22  10pF  [tu 0805]
C23  1uF  [tu 0603]
C24  1uF  [tu 0603]
C25  10uF  [tu 0805]
C26  10uF  [tu 0805]
C27  22uF  [tu 0805]
C28  22uF  [tu 0805]
C29  22uF  [tu 0805]
C30  22uF  [tu 0805]
C31  1uF  [tu 0805]
C32  22uF  [tu 0805]
C33  22uF  [tu 0805]
C34  22uF  [tu 0805]
C35  22uF  [tu 0805]
C36  22uF  [tu 0805]
D2  1N5819HW-7-F  [SOD3715X145N]
D3  LESD5D5.0CT1G  [TVS_LESD5D5.0CT1G]
D4  LESD5D5.0CT1G  [TVS_LESD5D5.0CT1G]
D5  LESD5D5.0CT1G  [TVS_LESD5D5.0CT1G]
D6  1N5819HW-7-F  [SOD3715X145N]
D7  LESD5D5.0CT1G  [TVS_LESD5D5.0CT1G]
D8  LESD5D5.0CT1G  [TVS_LESD5D5.0CT1G]
D9  LESD5D5.0CT1G  [TVS_LESD5D5.0CT1G]
ESP1  USB3100-XX-X_REVB  [GCT_USB3100-XX-X_REVB]
L1  LED 0805  [LED-1206-Red]
L2  120R  [IND-0603 (1608)]
L3  120R  [IND-0603 (1608)]
L4  LED 0805  [LED-1206-Green]
L5  LED 0805  [LED-1206-Green]
L6  LED 0805  [LED-1206-Green]
R22  1k  [tro smd 0805]
R23  1k  [tro smd 0805]
R24  1k  [tro smd 0805]
R25  1k  [tro smd 0805]
R26  1k  [tro smd 0805]
R27  1k  [tro smd 0805]
S3  EG1218  [SW_EG1218]
STM1  USB3100-XX-X_REVB  [GCT_USB3100-XX-X_REVB]
U4  MAX1555EZK+T  [SOT95P275X110-5N]
U5  LT6650IS5#TRPBF  [SOT95P280X100-5N]
U6  AP7331-18WG-7  [SOT95P285X145-5N]

### Ports
USB_D_M (bidir), USB_D_P (bidir), USB_ESP_M (bidir), USB_ESP_P (bidir)

### Nets
+1.8V: L6.2(K) R27.1
+3.3_STM32V: AMS1.2(VOUT) AMS1.4(VOUT) C28.1 C31.1 L4.1(A) U6.1(IN) U6.3(EN)
+5V: AMS1.3(VIN) AMS2.3(VIN) AMS3.3(VIN) AMS4.3(VIN) C27.1 C29.1 C32.1 C35.1 S3.2(COM)
+AVCC: AMS4.2(VOUT) AMS4.4(VOUT) C23.1 C36.1 R26.1 U5.4(IN)
+ESP_3.3V: AMS3.2(VOUT) AMS3.4(VOUT) C33.1 L5.1(A)
+V_Bus_USB: D6.A D9.2 ESP1.1(VBUS)
+V_ESP_USB: C25.1 L3.1
+Vdriver: AMS2.2(VOUT) AMS2.4(VOUT) C30.1 R24.1
Batterry: Batterry1.1 C22.1 S3.1(NC) U4.5(BAT)  [also labelled +VBAT]
Charging: C20.1 L2.1 S3.3(NO)  [also labelled +VUSB]
d4V: C24.1 U5.1(FB) U5.5(OUT)
GND: AMS1.1(GND) AMS2.1(GND) AMS3.1(GND) AMS4.1(GND) Batterry1.2 C20.2 C21.2 C22.2 C23.2 C24.2 C25.2 C26.2 C27.2 C28.2 C29.2 C30.2 C31.2 C32.2 C33.2 C34.2 C35.2 C36.2 D3.1 D4.1 D5.1 D7.1 D8.1 D9.1 ESP1.5(GND) R23.2 R24.2 R25.2 R26.2 R27.2 STM1.5(GND) U4.2(GND) U5.2(GND) U6.2(GND)
NetC21_1: C21.1 D2.C(K) L2.2
NetC26_1: C26.1 D6.C(K) L3.2
NetC34_1: C34.1 L6.1(A) U6.5(OUT)
NetD2_A: D2.A D5.2 STM1.1(VBUS)
NetD3_2: D3.2 STM1.3(D+) ; port USB_D_P
NetD4_2: D4.2 STM1.2(D-) ; port USB_D_M
NetD7_2: D7.2 ESP1.3(D+) ; port USB_ESP_P
NetD8_2: D8.2 ESP1.2(D-) ; port USB_ESP_M
NetL1_1: L1.1(A) R22.1
NetL1_2: L1.2(K) U4.3(~{CHG})
NetL4_2: L4.2(K) R23.1
NetL5_2: L5.2(K) R25.1
NetR22_2: R22.2 U4.1(USB)

Not connected (* = marked no-connect by the designer): ESP1 4(ID)* 6(SHIELD)* 7(SHIELD)* 8(SHIELD)* 9(SHIELD)*; STM1 4(ID)* 6(SHIELD)* 7(SHIELD)* 8(SHIELD)* 9(SHIELD)*; U4 4(DC)*; U5 3(DNC)*

### Layout directives
differential pair: (no net found under the mark)

### Notes on the sheet
- IMU Power Supply
- Title
- Size:
- Date:
- A3
- Number:
- Time:
- Revision:
- Sheet
- of
- File:

### Library data of the parts
AMS1-AMS4 = AMS1117 SMD: Dán; Value: AMS1117-3.3V SOT223; Don_Vi: Con; Ma_Hang: MH000596; Ghi_Chu: *; Kieu_Chan: *; Chung_Loai: Dán
Batterry1 = Header 2P 2.54 Duc Thang: Cắm; Ten_Linh_Kien: Header 2P XH2.54-2P Đực Thẳng; Don_Vi: Con; Ma_Hang: MH001283; Chung_Loai: Cắm
C20-C22 C25-C30 C32-C36 = Tu 0805 10pF 50V 10%: as C37 on sheet ESP32; Chung_Loai: Dán; Kieu_Chan: *
C23 C24 = Tu 0603 470pF 50V 10%: as C1 on sheet AnalogSensor; Chung_Loai: Dán; Kieu_Chan: *
C31 = Tu 0805 106 16V 10%: as C15 on sheet Peripherial; Chung_Loai: Dán; Kieu_Chan: *
D2 D6 = 1N5819HW-7-F: 1N5819HW Series 40 V 1 A Surface Mount Schottky Barrier Rectifier - SOD-123; MF: {'manufacturer': u'Diodes Inc.'}; Package: None; Price: None; Value: *; MP: 1N5819HW-7-F; Availability: Unavailable
D3-D5 D7-D9 = LESD5D5.0CT1G: MF: {'manufacturer': u'Leshan Radio Co.'}; Package: None; Price: None; Value: *; MP: LESD5D5.0CT1G; Availability: Unavailable
ESP1 STM1 = USB3100-XX-X_REVB: Micro USB Receptacle, Type B, Surface Mount, Horizontal, Top (Reverse) Mount, without Peg; MF: {'manufacturer': u'Global Connector Technology'}; Package: None; Price: None; Value: *; MP: USB3100-XX-X_REVB; Availability: Unavailable
L1 = LED 1206 Do: Dán; Don_Vi: Con; Ma_Hang: MH002334; Ten_Linh_Kien: LED1206 Màu Đỏ (Red); Ghi_Chu: *; Kieu_Chan: *; Chung_Loai: Dán
L2 L3 = FBMJ1608HM230NT: IND-FERRITE BEAD 23 OHM  4A 0603 1LN; CompanyID: VT-01060; Solder: SMT; Value: 23R/4A; MPN: FBMJ1608HM230NT; Category: FERRITE BEAD; PinCount: 2
L4-L6 = LED 1206 Xanh La: Dán; Don_Vi: Con; Ma_Hang: MH002947; Ten_Linh_Kien: LED1206 Màu Xanh Lá (Green); Ghi_Chu: *; Kieu_Chan: *; Chung_Loai: Dán
R22-R27 = Tro 0805 1% 1k: as R28 on sheet ESP32; Chung_Loai: Dán; Kieu_Chan: *
S3 = EG1218: as S2 on sheet STM32; SnapEDA_Link: https://www.snapeda.com/parts/EG1218/E-Switch/view-part/?ref=snap; Package: None; Value: *; MF: E-Switch; MP: EG1218; Check_prices: https://www.snapeda.com/parts/EG1218/E-Switch/view-part/?ref=eda
U4 = MAX1555EZK+T: MF: {'manufacturer': u'Analog Devices'}; Package: None; Price: None; Value: *; MP: MAX1555EZK+; Availability: Unavailable
U5 = LT6650IS5#TRPBF: Micropower, 400mV Reference with Rail-to-Rail Buffer Amplifier; MF: {'manufacturer': u'Analog Devices'}; Package: None; Price: None; Value: *; MP: LT6650IS5#TRPBF; Availability: Unavailable
U6 = AP7331-18WG-7: LDO Regulator Pos 1.8V 0.3A 5-Pin SOT-25 T/R; MF: {'manufacturer': u'Diodes Inc.'}; Package: None; Price: None; Value: *; MP: AP7331-18WG-7; Availability: Unavailable

## Nets that join several sheets
+1.8V: Peripherial (C15.1 C16.1 U3.8 U3.13), PWR_SRC (L6.2 R27.1)
+3.3_STM32V: STM32 (19 pins), Peripherial (CAN1.3), PWR_SRC (7 pins)
+AVCC: AnalogSensor (U1.8), PWR_SRC (6 pins)
+ESP_3.3V: ESP32 (8 pins), PWR_SRC (AMS3.2 AMS3.4 C33.1 L5.1)
+V_Bus_USB: ESP32 (R31.1), PWR_SRC (D6.A D9.2 ESP1.1)
d4V: AnalogSensor (U1.3 U1.5), PWR_SRC (C24.1 U5.1 U5.5)
GND: ESP32 (25 pins), AnalogSensor (U1.4 VR1.3 VR2.1), STM32 (30 pins), Peripherial (12 pins), PWR_SRC (38 pins)
NetADC1_1: AnalogSensor (C1.2 U1.2 VR1.1), Peripherial (ADC1.1)
NetADC2_1: AnalogSensor (C2.2 U1.6 VR2.3), Peripherial (ADC2.1)
NetC1_1: AnalogSensor (C1.1 U1.1 VR1.2), STM32 (U2.10)
NetC2_1: AnalogSensor (C2.1 U1.7 VR2.2), STM32 (U2.11)
NetCAN1_1: STM32 (U2.34), Peripherial (CAN1.1)
NetCAN1_4: STM32 (U2.33), Peripherial (CAN1.4)
NetD3_2: STM32 (U2.45), PWR_SRC (D3.2 STM1.3)
NetD4_2: STM32 (U2.44), PWR_SRC (D4.2 STM1.2)
NetD7_2: ESP32 (U7.4), PWR_SRC (D7.2 ESP1.3)
NetD8_2: ESP32 (U7.5), PWR_SRC (D8.2 ESP1.2)
NetU2_20: STM32 (U2.20), Peripherial (U3.22)
NetU2_21: STM32 (U2.21), Peripherial (U3.9)
NetU2_22: STM32 (U2.22), Peripherial (U3.24)
NetU2_23: STM32 (U2.23), Peripherial (U3.23)
NetU2_24: STM32 (U2.24), Peripherial (U3.12)
NRST: ESP32 (U8.13), STM32 (5 pins)